# EAGLE design sens_less_blmd (EAGLE 9.6.2)
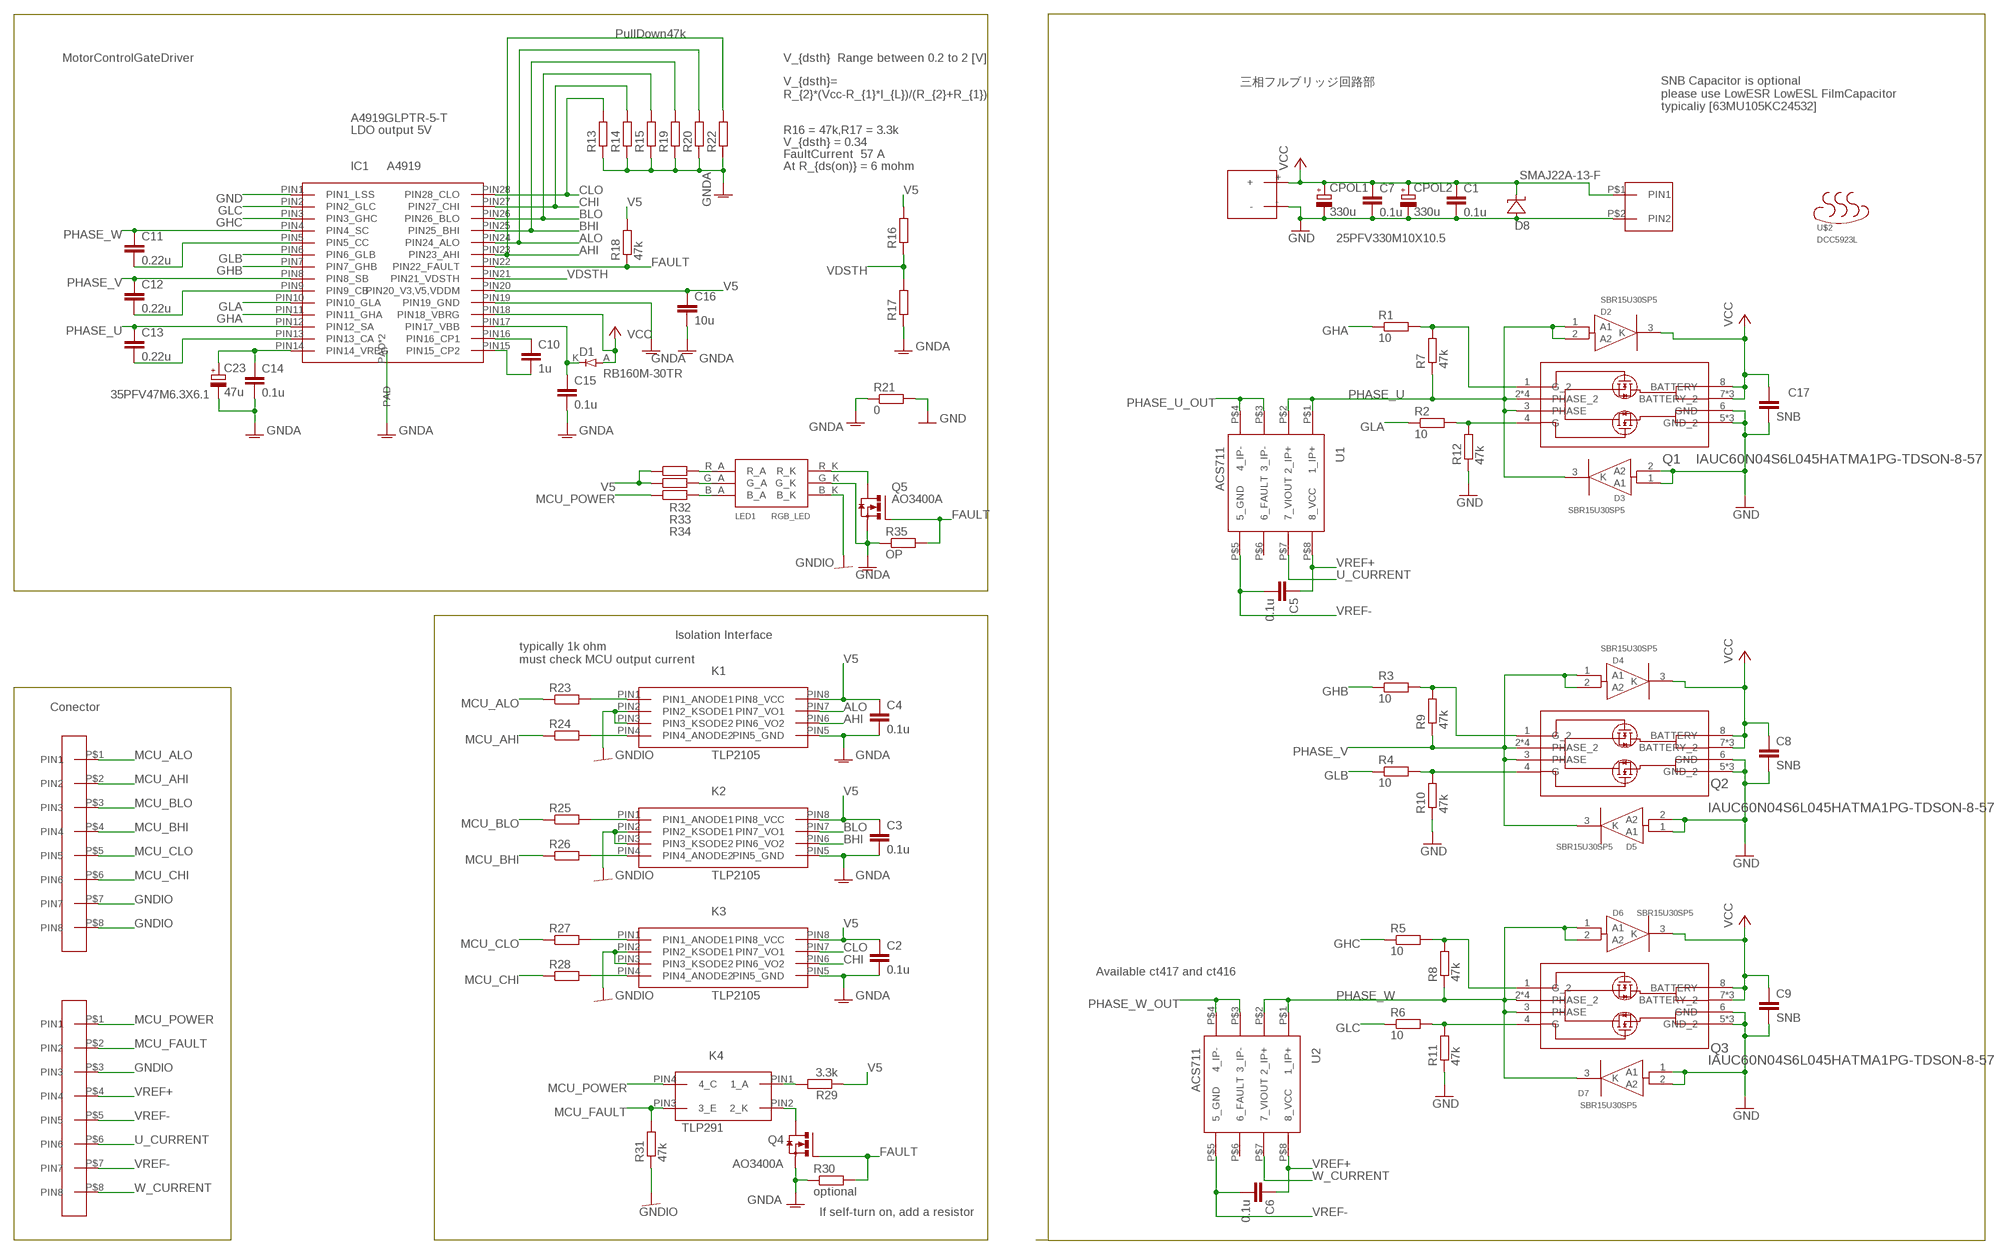
[diagram p0: schematic, sheet 1]

## Parts
C1  0.1u  C-EUC1608  [C1608]
C2  0.1u  C-EUC1608  [C1608]
C3  0.1u  C-EUC1608  [C1608]
C4  0.1u  C-EUC1608  [C1608]
C5  0.1u  C-EUC1608  [C1608]
C6  0.1u  C-EUC1608  [C1608]
C7  0.1u  C-EUC1608  [C1608]
C8  SNB  C-EUC4532  [C4532]
C9  SNB  C-EUC4532  [C4532]
C10  1u  C-EUC1608  [C1608]
C11  0.22u  C-EUC1608  [C1608]
C12  0.22u  C-EUC1608  [C1608]
C13  0.22u  C-EUC1608  [C1608]
C14  0.1u  C-EUC1608  [C1608]
C15  0.1u  C-EUC1608  [C1608]
C16  10u  C-EUC1608  [C1608]
C17  SNB  C-EUC4532  [C4532]
C23  47u  CPOL-EU153CLV-0605  [153CLV-0605]
CON1  XH_8P  [XH_8P]
CON2  XH_8P  [XH_8P]
CPOL1  330u  C_DEKAI  [1014CAPA]
CPOL2  330u  C_DEKAI  [1014CAPA]
D1  RB160M-30TR  SMD_DAIOD  [SOD_123]
D2  SBR15U30SP5  [POWERDI_5]
D3  SBR15U30SP5  [POWERDI_5]
D4  SBR15U30SP5  [POWERDI_5]
D5  SBR15U30SP5  [POWERDI_5]
D6  SBR15U30SP5  [POWERDI_5]
D7  SBR15U30SP5  [POWERDI_5]
D8  SMAJ22A-13-F  [DO-214AC]
IC1  A4919  [TSSOP_28P_ALLEGRO_E]
K1  TLP2105  [SOP8]
K2  TLP2105  [SOP8]
K3  TLP2105  [SOP8]
K4  TLP291  [TLP291]
LED1  RGB_LED  [RGB_LED]
Q1  IAUC60N04S6L045HATMA1PG-TDSON-8-57  [PG-TDSON-8-57]
Q2  IAUC60N04S6L045HATMA1PG-TDSON-8-57  [PG-TDSON-8-57]
Q3  IAUC60N04S6L045HATMA1PG-TDSON-8-57  [PG-TDSON-8-57]
Q4  AO3400A  SOT23_NFET  [SOT23]
Q5  AO3400A  SOT23_NFET  [SOT23]
R1  10  R_REG  [1608]
R2  10  R_REG  [1608]
R3  10  R_REG  [1608]
R4  10  R_REG  [1608]
R5  10  R_REG  [1608]
R6  10  R_REG  [1608]
R7  47k  R_REG  [1608]
R8  47k  R_REG  [1608]
R9  47k  R_REG  [1608]
R10  47k  R_REG  [1608]
R11  47k  R_REG  [1608]
R12  47k  R_REG  [1608]
R13  R_REG  [1608]
R14  R_REG  [1608]
R15  R_REG  [1608]
R16  R_REG  [1608]
R17  R_REG  [1608]
R18  47k  R_REG  [1608]
R19  R_REG  [1608]
R20  R_REG  [1608]
R21  0  R_REG  [1608]
R22  R_REG  [1608]
R23  R_REG  [1608]
R24  R_REG  [1608]
R25  R_REG  [1608]
R26  R_REG  [1608]
R27  R_REG  [1608]
R28  R_REG  [1608]
R29  3.3k  R_REG  [1608]
R30  optional  R_REG  [1608]
R31  47k  R_REG  [1608]
R32  R_REG  [1608]
R33  R_REG  [1608]
R34  R_REG  [1608]
R35  OP  R_REG  [1608]
U1  ACS711  [SOIC8]
U2  ACS711  [SOIC8]
U$1  XH_2P  [XH_2P]
U$2  DCC5923L  [DCC5923L]
U$22  XT60  [XT60]

## Nets
AHI: IC1.PIN23(PIN23_AHI) K1.PIN6(PIN6_VO2) R22.2
ALO: IC1.PIN24(PIN24_ALO) K1.PIN7(PIN7_VO1) R20.2
BHI: IC1.PIN25(PIN25_BHI) K2.PIN6(PIN6_VO2) R19.2
BLO: IC1.PIN26(PIN26_BLO) K2.PIN7(PIN7_VO1) R15.2
CHI: IC1.PIN27(PIN27_CHI) K3.PIN6(PIN6_VO2) R14.2
CLO: IC1.PIN28(PIN28_CLO) K3.PIN7(PIN7_VO1) R13.2
FAULT: IC1.PIN22(PIN22_FAULT) Q4.PIN1(PIN1_G) Q5.PIN1(PIN1_G) R18.1 R30.2 R35.2
GHA: IC1.PIN11(PIN11_GHA) R1.1
GHB: IC1.PIN7(PIN7_GHB) R3.1
GHC: IC1.PIN3(PIN3_GHC) R5.1
GLA: IC1.PIN10(PIN10_GLA) R2.1
GLB: IC1.PIN6(PIN6_GLB) R4.1
GLC: IC1.PIN2(PIN2_GLC) R6.1
GND: C1.2 C7.2 C8.2 C9.2 C17.2 CPOL1.- CPOL2.- D3.1(A1) D3.2(A2) D5.1(A1) D5.2(A2) D7.1(A1) D7.2(A2) D8.A IC1.PIN1(PIN1_LSS) Q1.5(GND_2) Q1.6(GND) Q1.SPAD(GND_2) Q1.SPAD@1(GND_2) Q2.5(GND_2) Q2.6(GND) Q2.SPAD(GND_2) Q2.SPAD@1(GND_2) Q3.5(GND_2) Q3.6(GND) Q3.SPAD(GND_2) Q3.SPAD@1(GND_2) R10.1 R11.1 R12.1 R21.2 U$1.P$2(PIN2) U$22.-
GNDA: C2.2 C3.2 C4.2 C14.2 C15.2 C16.2 C23.- IC1.PAD IC1.PAD@14(PAD) IC1.PIN19(PIN19_GND) K1.PIN5(PIN5_GND) K2.PIN5(PIN5_GND) K3.PIN5(PIN5_GND) LED1.G_K Q4.PIN2(PIN3_S) Q5.PIN2(PIN3_S) R13.1 R14.1 R15.1 R17.1 R19.1 R20.1 R21.1 R22.1 R30.1 R35.1
GNDIO: CON1.P$3(PIN3) CON2.P$7(PIN7) CON2.P$8(PIN8) K1.PIN2(PIN2_KSODE1) K1.PIN3(PIN3_KSODE2) K2.PIN2(PIN2_KSODE1) K2.PIN3(PIN3_KSODE2) K3.PIN2(PIN2_KSODE1) K3.PIN3(PIN3_KSODE2) LED1.B_K R31.1
MCU_AHI: CON2.P$2(PIN2) R24.1
MCU_ALO: CON2.P$1(PIN1) R23.1
MCU_BHI: CON2.P$4(PIN4) R26.1
MCU_BLO: CON2.P$3(PIN3) R25.1
MCU_CHI: CON2.P$6(PIN6) R28.1
MCU_CLO: CON2.P$5(PIN5) R27.1
MCU_FAULT: CON1.P$2(PIN2) K4.PIN3(3_E) R31.2
MCU_POWER: CON1.P$1(PIN1) K4.PIN4(4_C) R34.1
N$1: Q1.1(G_2) R1.2 R7.2
N$2: Q1.4(G) R2.2 R12.2
N$3: Q2.4(G) R4.2 R10.2
N$4: LED1.B_A R34.2
N$5: Q3.1(G_2) R5.2 R8.2
N$6: Q3.4(G) R6.2 R11.2
N$7: C10.1 IC1.PIN16(PIN16_CP1)
N$8: C10.2 IC1.PIN15(PIN15_CP2)
N$9: C14.1 C23.+ IC1.PIN14(PIN14_VREG)
N$11: K1.PIN1(PIN1_ANODE1) R23.2
N$12: K1.PIN4(PIN4_ANODE2) R24.2
N$13: K2.PIN1(PIN1_ANODE1) R25.2
N$14: K2.PIN4(PIN4_ANODE2) R26.2
N$15: K3.PIN1(PIN1_ANODE1) R27.2
N$16: C13.2 IC1.PIN13(PIN13_CA)
N$17: C12.2 IC1.PIN9(PIN9_CB)
N$18: C11.2 IC1.PIN5(PIN5_CC)
N$19: K3.PIN4(PIN4_ANODE2) R28.2
N$20: K4.PIN2(2_K) Q4.PIN3(PIN2_D)
N$21: C15.1 D1.K(C) IC1.PIN17(PIN17_VBB)
N$22: K4.PIN1(1_A) R29.2
N$23: Q2.1(G_2) R3.2 R9.2
N$24: LED1.G_A R33.2
N$25: LED1.R_A R32.2
N$26: LED1.R_K Q5.PIN3(PIN2_D)
PHASE_U: C13.1 D2.1(A1) D2.2(A2) D3.3(K) IC1.PIN12(PIN12_SA) Q1.2(PHASE_2) Q1.3(PHASE) Q1.SDPAD(PHASE_2) Q1.SDPAD@1(PHASE_2) Q1.SDPAD@2(PHASE_2) R7.1 U1.P$1(1_IP+) U1.P$2(2_IP+)
PHASE_U_OUT: U1.P$3(3_IP-) U1.P$4(4_IP-)
PHASE_V: C12.1 D4.1(A1) D4.2(A2) D5.3(K) IC1.PIN8(PIN8_SB) Q2.2(PHASE_2) Q2.3(PHASE) Q2.SDPAD(PHASE_2) Q2.SDPAD@1(PHASE_2) Q2.SDPAD@2(PHASE_2) R9.1
PHASE_W: C11.1 D6.1(A1) D6.2(A2) D7.3(K) IC1.PIN4(PIN4_SC) Q3.2(PHASE_2) Q3.3(PHASE) Q3.SDPAD(PHASE_2) Q3.SDPAD@1(PHASE_2) Q3.SDPAD@2(PHASE_2) R8.1 U2.P$1(1_IP+) U2.P$2(2_IP+)
PHASE_W_OUT: U2.P$3(3_IP-) U2.P$4(4_IP-)
U_CURRENT: CON1.P$6(PIN6) U1.P$7(7_VIOUT)
V5: C2.1 C3.1 C4.1 C16.1 IC1.PIN20(PIN20_V3,V5,VDDM) K1.PIN8(PIN8_VCC) K2.PIN8(PIN8_VCC) K3.PIN8(PIN8_VCC) R16.2 R18.2 R29.1 R32.1 R33.1
VCC: C1.1 C7.1 C8.1 C9.1 C17.1 CPOL1.+ CPOL2.+ D1.A D2.3(K) D4.3(K) D6.3(K) D8.C IC1.PIN18(PIN18_VBRG) Q1.7(BATTERY_2) Q1.8(BATTERY) Q1.DPAD(BATTERY_2) Q1.DPAD@1(BATTERY_2) Q2.7(BATTERY_2) Q2.8(BATTERY) Q2.DPAD(BATTERY_2) Q2.DPAD@1(BATTERY_2) Q3.7(BATTERY_2) Q3.8(BATTERY) Q3.DPAD(BATTERY_2) Q3.DPAD@1(BATTERY_2) U$1.P$1(PIN1) U$22.+
VDSTH: IC1.PIN21(PIN21_VDSTH) R16.1 R17.2
VREF+: C5.1 C6.1 CON1.P$4(PIN4) U1.P$8(8_VCC) U2.P$8(8_VCC)
VREF-: C5.2 C6.2 CON1.P$5(PIN5) CON1.P$7(PIN7) U1.P$5(5_GND) U2.P$5(5_GND)
W_CURRENT: CON1.P$8(PIN8) U2.P$7(7_VIOUT)
Unconnected: U1.P$6(6_FAULT) U2.P$6(6_FAULT)

## Notes on the sheet
- PullDown47k
- MotorControlGateDriver | V_{dsth}  Range between 0.2 to 2 [V]
- 三相フルブリッジ回路部
- V_{dsth}=
  R_{2}*(Vcc-R_{1}*I_{L})/(R_{2}+R_{1})
- SNB Capacitor is optional
  please use LowESR LowESL FilmCapacitor
  typicaliy [63MU105KC24532]
- A4919GLPTR-5-T
- LDO output 5V | R16 = 47k,R17 = 3.3k
- V_{dsth} = 0.34
- FaultCurrent  57 A
- At R_{ds(on)} = 6 mohm
- 25PFV330M10X10.5
- 35PFV47M6.3X6.1
- Isolation Interface
- typically 1k ohm
  must check MCU output current
- Conector
- Available ct417 and ct416
- If self-turn on, add a resistor

## Library data of the parts
C1-C17 = rcl:C-EU: CAPACITOR, European symbol; SPICEPREFIX: C
C23 = rcl:CPOL-EU: POLARIZED CAPACITOR, European symbol; SPICEPREFIX: C
CON1 CON2 = user_conector:XH_8P: jst JQコネクタ8pin ベース付きポスト 基板対基板コネクタ
CPOL1 CPOL2 = user_rcl:C_DEKAI
D1 = user_diode:SMD_DAIOD: パッケージはSOD123
D2-D7 = user_diode:SBR15U30SP5: Diodes スーパーバリア！（デデン！）ダイオード SBR15U30SP5 逆耐圧 30V 平均順電流 15A 瞬間電流 280A 順方向電圧降下 0.49V 秋月電子 通販コード : I-07391 Trrも記載されてればいいのになぁ。多分SBRのもとのショットキー自体がそこそこはやくそれをさらに高性能にしたものだから多分はやいんじゃね
D8 = user_diode:SMAJ22A-13-F: SMAJ22A-13-F TVSダイオード 逆スタンドオフ電圧:22V ブレークダウン電圧:24V 最大消費電力:400W
IC1 = user_ic:A4919: アレグロ：ブラシレスモータドライバ用ゲートドライバIC 純粋な両サイドNchハーフブリッジ3つを駆動するゲートドライバIC digikey：通販コード[620-1893-1-ND] 単価：353円
K1-K3 = user_ic:TLP2105: 二回路入り高速フォトカプラ ステートバッファ出力 秋月電子で買える 100nSほどの遅延
K4 = user_ic:TLP291: フォトリフレクタ オープンドレイン インバータ出力 秋月電子で買える
LED1 = user_leds:RGB_LED: KPF-3236SURKMGKPBC 秋月電子通商 117060
Q1-Q3 = user_tr_fet_igbt:IAUC60N04S6L045HATMA1: IAUC60N04S6L045HATMA1 digikey:448-IAUC60N04S6L045HATMA1CT-ND ハーフブリッジNchFET 40V 60A; COPYRIGHT: Copyright (C) 2024 Ultra Librarian. All rights reserved.; MANUFACTURER_PART_NUMBER: IAUC60N04S6L045HATMA1; MFR_NAME: Infineon
Q4 Q5 = user_tr_fet_igbt:SOT23_NFET
R1-R35 = user_rcl:R_REG: チップ抵抗
U1 U2 = user_ic:ACS711: アレグロ 電流センサIC ホールセンサ式の絶縁型電流センサ 12.5A、25Aの測定レンジの種類がある digikey：620-1372-1-ND 単価：295
U$1 = user_conector:XH_2P: トップ型xhコネクタ2ピン 秋月に売ってるやつ
U$2 = user_heatshink:DCC5923L: DCC5923L ALPHA 58.5x23 高さ設定可
U$22 = user_conector:XT60

## Board
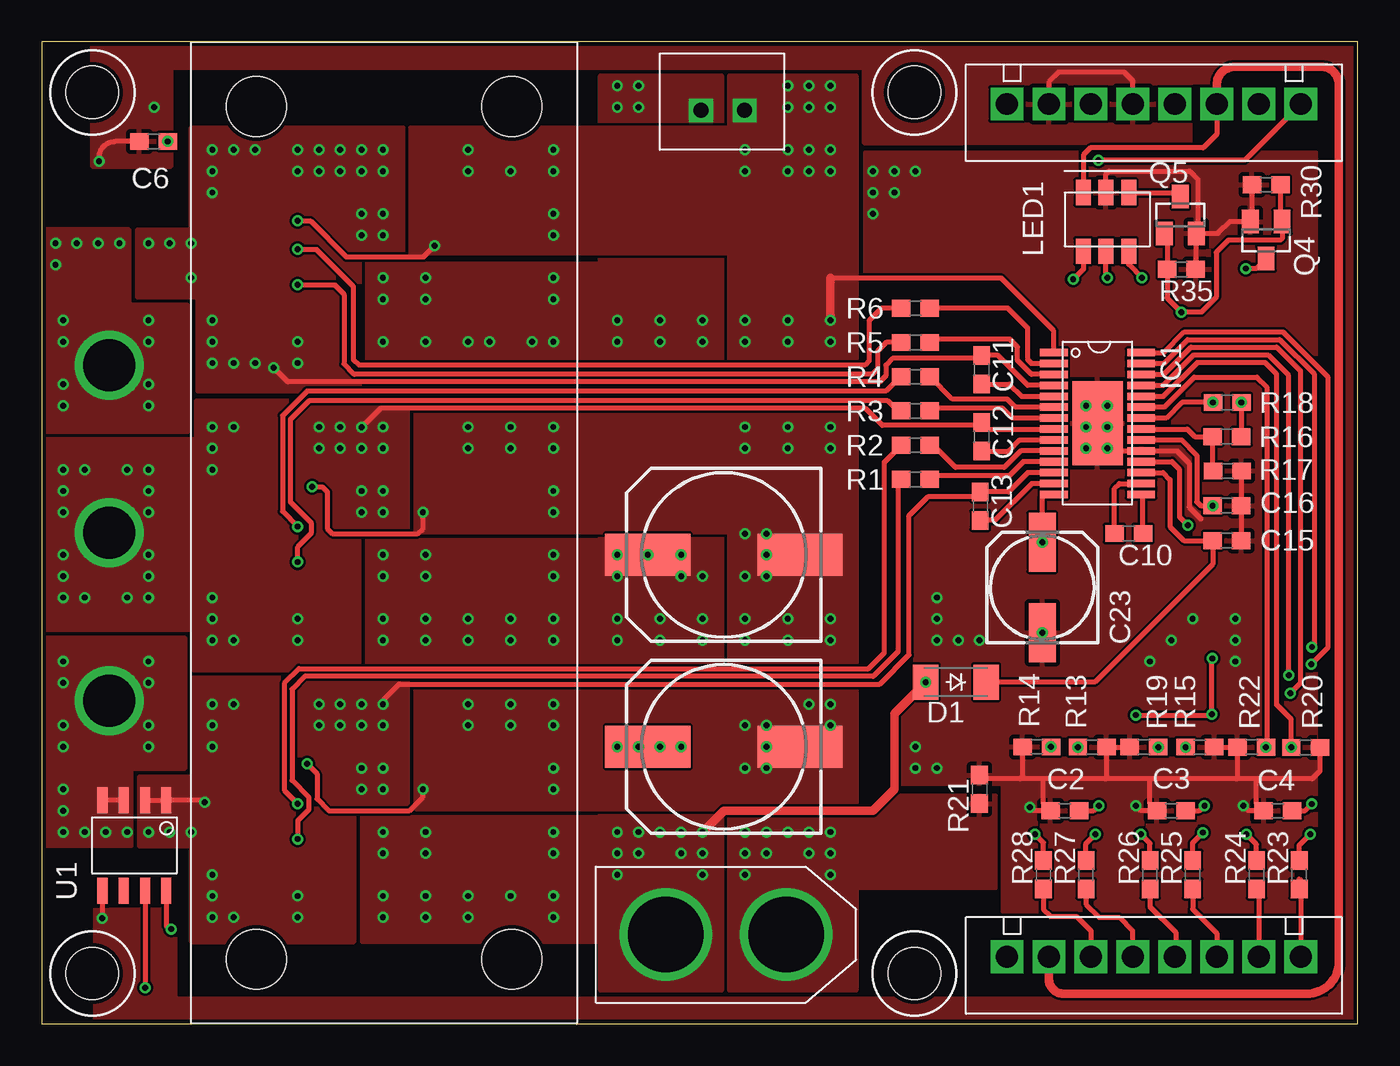
[diagram p1: board, top side]
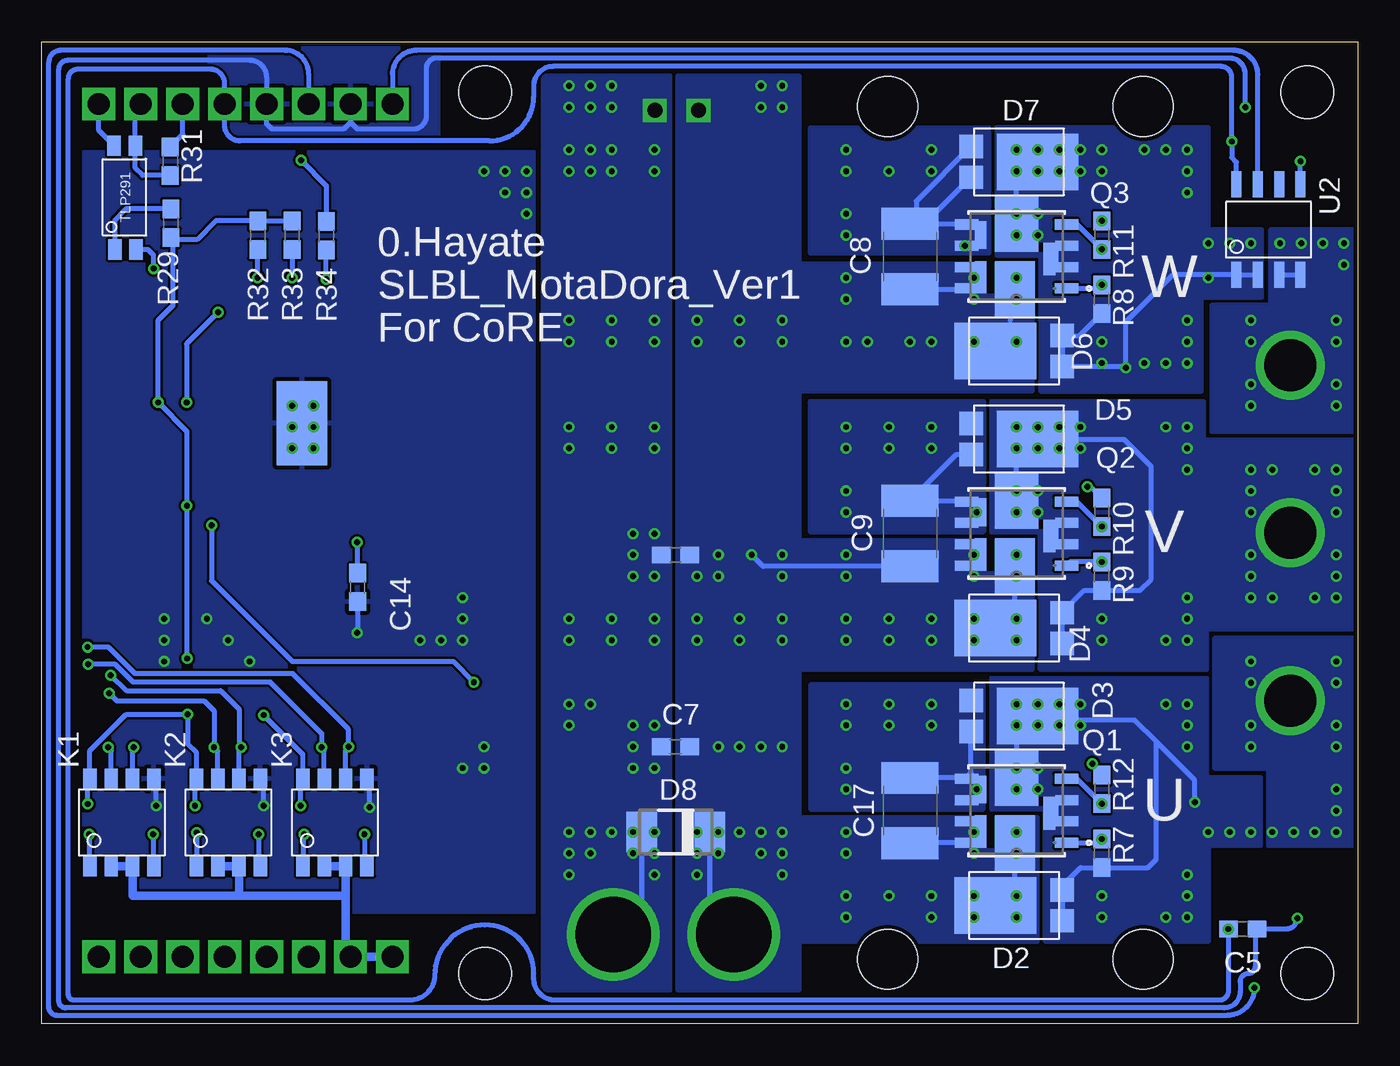
[diagram p2: board, bottom side, seen from below]

Size 78.41 x 58.5 mm. Coordinates in mm from the lower left corner, seen from the top.
Outline: 0,0 78.41,0 78.41,58.5 0,58.5 0,0
Copper layers (1*16): Top 0.035mm / dielectric 1.5mm / Bottom 0.035mm
Design rules "SeeedStudio_2layer_DRU_no_angle_20140221": minimum track width 6mil, minimum drill 12mil, track to track 6mil, track to pad 6mil, pad to pad 6mil, via to via 6mil, smd to smd 0mil, copper to edge 10mil, drill to drill 10mil, minimum pad ring 10mil, minimum via ring 6mil, stop-mask expansion 2mil, vias tented up to drill 100mil, thermal gap 10mil
Holes 3.1 mm at 3,55.5 3,3 52,3 52,55.5

### Footprints (pad centres in the part's own frame; a part is rotated, then mirrored left to right if it is on the bottom)
C1608 = smd 1.1 x 1: 1 -0.85,0; 2 0.85,0
C4532 = smd 1.9 x 3.4: 1 -1.95,0; 2 1.95,0
153CLV-0605 = smd 3.5 x 1.6: + 2.7,0; - -2.7,0
XH_8P = drill 1.3 square: P$1 2.45,2.35; P$2 4.95,2.35; P$3 7.45,2.35; P$4 9.95,2.35; P$5 12.45,2.35; P$6 14.95,2.35; P$7 17.45,2.35; P$8 19.95,2.35
1014CAPA = smd 5.079 x 2.5: + 4.531,0; - -4.531,0
SOD_123 = smd 1.5 x 2.1: A 1.8,0; K -1.8,0
POWERDI_5 = smd 1.39 x 1.4: 1 1.063,-0.177; 2 2.903,-0.177 | smd 3.36 x 4.86: 3 1.983,3.805
DO-214AC = smd 1.8 x 2.4: A 2.025,0; C -2.025,0
TSSOP_28P_ALLEGRO_E = smd 5 x 3: PAD 4.85,1.95 | smd 5 x 3 bottom: PAD@14 4.85,1.95 | smd 0.45 x 1.65: PIN1 0.65,-0.65; PIN2 1.3,-0.65; PIN3 1.95,-0.65; PIN4 2.6,-0.65; PIN5 3.25,-0.65; PIN6 3.9,-0.65; PIN7 4.55,-0.65; PIN8 5.2,-0.65; PIN9 5.85,-0.65; PIN10 6.5,-0.65; PIN11 7.15,-0.65; PIN12 7.8,-0.65; PIN13 8.45,-0.65; PIN14 9.1,-0.65; PIN15 9.1,4.55; PIN16 8.45,4.55; PIN17 7.8,4.55; PIN18 7.15,4.55; PIN19 6.5,4.55; PIN20 5.85,4.55; PIN21 5.2,4.55; PIN22 4.55,4.55; PIN23 3.9,4.55; PIN24 3.25,4.55; PIN25 2.6,4.55; PIN26 1.95,4.55; PIN27 1.3,4.55; PIN28 0.65,4.55
SOP8 = smd 0.8 x 1.2: PIN1 0.65,-4.57; PIN2 1.92,-4.57; PIN3 3.19,-4.57; PIN4 4.46,-4.57; PIN5 4.46,0.62; PIN6 3.19,0.62; PIN7 1.92,0.62; PIN8 0.65,0.62
TLP291 = smd 1.2 x 0.8: PIN1 0.411,-0.862; PIN2 0.411,-2.132; PIN3 6.601,-2.092; PIN4 6.601,-0.822
RGB_LED = smd 1.5 x 0.9: B_A 3.5,-2.7; B_K 0,-2.7; G_A 3.5,-1.35; G_K 0,-1.35; R_A 3.5,0; R_K 0,0
PG-TDSON-8-57 = smd 1.4 x 0.6: 1 -2.97,1.905; 4 -2.97,-1.905 | smd 1.17 x 0.6: 2 -3.085,0.635; 3 -3.085,-0.635; 5 3.085,-1.905; 6 3.085,-0.635; 7 3.085,0.635; 8 3.085,1.905 | smd 2.39 x 3.315: DPAD 0.105,1.942 | smd 0.7 x 1.92: DPAD@1 2.15,1.245 | smd 2.6 x 3.315: SDPAD 0,-1.942 | smd 0.7 x 1.95: SDPAD@1 -1.96,0.15 | smd 0.19 x 1.87: SDPAD@2 -2.405,0 | smd 0.47 x 1.65: SPAD 2.035,-1.27 | smd 0.23 x 1.87: SPAD@1 2.385,-1.27
SOT23 = smd 1 x 1.4: PIN1 -0.95,-1.1; PIN2 0.95,-1.1; PIN3 0,1.1
1608 = smd 1.1 x 1: 1 -0.85,0; 2 0.85,0
SOIC8 = smd 1.55 x 0.6: P$1 -2.7,1.905; P$2 -2.7,0.635; P$3 -2.7,-0.635; P$4 -2.7,-1.905; P$5 2.7,-1.905; P$6 2.7,-0.635; P$7 2.7,0.635; P$8 2.7,1.905
XH_2P = drill 0.9 square: P$1 2.45,2.35; P$2 5.05,2.35
DCC5923L = hole 3.56: 3.88,3.85; 19.12,3.85; 19.12,54.65; 3.88,54.65
XT60 = drill 4.5: + 4.15,4.05; - 11.35,4.05

### Placement (x,y rotation side)
C1  40.64,27.94 180 bottom
C2  60.96,12.7 180 top
C3  67.31,12.7 180 top
C4  73.66,12.7 180 top
C5  6.85,5.65 0 bottom
C6  6.65,52.57 180 top
C7  40.64,16.51 180 bottom
C8  26.67,45.72 90 bottom
C9  26.67,29.21 90 bottom
C10  64.77,29.21 0 top
C11  56,38.97 270 top
C12  56,34.97 270 top
C13  55.92,30.85 270 top
C14  59.6,26 270 bottom
C15  70.62,28.79 0 top
C16  70.62,30.87 0 top
C17  26.67,12.7 90 bottom
C23  59.62,26 90 top
CON1  77.47,57.15 180 top
CON2  77.47,6.35 180 top
CPOL1  40.64,27.94 180 top
CPOL2  40.64,16.51 180 top
D1  54.47,20.36 180 top
D2  17.78,5.08 90 bottom
D3  22.86,20.32 270 bottom
D4  17.78,21.59 90 bottom
D5  22.86,36.83 270 bottom
D6  17.78,38.1 90 bottom
D7  22.86,53.34 270 bottom
D8  40.64,11.43 180 bottom
IC1  60.96,40.64 270 top
K1  76.2,13.97 0 bottom
K2  69.85,13.97 0 bottom
K3  63.5,13.97 0 bottom
K4  74.93,45.72 90 bottom
LED1  64.77,49.53 270 top
Q1  20.32,12.7 180 bottom
Q2  20.32,29.21 180 bottom
Q3  20.32,45.72 180 bottom
Q4  72.96,46.69 180 top
Q5  67.85,48.19 0 top
R1  52.07,32.44 180 top
R2  52.07,34.48 180 top
R3  52.07,36.52 180 top
R4  52.07,38.56 180 top
R5  52.07,40.6 180 top
R6  52.07,42.64 180 top
R7  15.24,10.16 90 bottom
R8  15.24,43.18 90 bottom
R9  15.24,26.67 90 bottom
R10  15.24,30.48 270 bottom
R11  15.24,46.99 270 bottom
R12  15.24,13.97 270 bottom
R13  62.59,16.49 180 top
R14  59.29,16.5 0 top
R15  69.01,16.49 180 top
R16  70.62,34.98 0 top
R17  70.64,32.94 180 top
R18  70.64,37.02 0 top
R19  65.68,16.49 0 top
R20  75.31,16.47 180 top
R21  55.88,13.97 270 top
R22  72.1,16.48 0 top
R23  74.93,8.89 90 top
R24  72.39,8.89 90 top
R25  68.58,8.89 90 top
R26  66.04,8.89 90 top
R27  62.23,8.89 90 top
R28  59.69,8.89 90 top
R29  70.72,47.7 90 bottom
R30  72.96,49.99 0 top
R31  70.76,51.4 270 bottom
R32  65.54,46.99 270 bottom
R33  63.5,46.99 270 bottom
R34  61.46,46.96 270 bottom
R35  67.91,44.95 180 top
U1  5.51,10.63 270 top
U2  5.31,47.32 90 bottom
U$1  36.83,52.07 0 top
U$2  8.89,0 0 top
U$22  33.02,1.27 0 top

### Tracks (layer width: path | path; a pad name or v marks a point on that pad's centre or on a via)
AHI  (via drill 0.35)
  Top 0.305: IC1.PIN23 66.88,36.74 68.67,38.53 72.41,38.53 72.99,37.95 72.99,16.52 R22.2
  Bottom 0.305: K1.PIN6 73.01,16.42 R22.2
  other vias: 72.95,16.48
ALO  (via drill 0.35)
  Top 0.305: IC1.PIN24 66.84,37.39 68.85,39.4 72.9,39.4 73.58,38.72 73.58,19.03 74.46,18.15 R20.2
  Bottom 0.305: K1.PIN7 74.28,16.29 R20.2
  other vias: 74.46,16.47
BHI  (via drill 0.35)
  Top 0.305: IC1.PIN25 66.85,38.04 68.66,39.86 73.09,39.86 74.27,38.68 74.27,20.81 v74.3,20.78
  Bottom 0.305: K2.PIN6 66.66,16.36 | 66.66,16.36 R19.2 | v74.3,20.78 73.37,19.85 67.76,19.85 66.66,18.75 66.66,16.36
  other vias: 66.53,16.49
BLO  (via drill 0.35)
  Top 0.305: IC1.PIN26 66.85,38.69 68.47,40.31 73.59,40.31 75,38.9 75,20.3 v74.4,19.7
  Bottom 0.305: K2.PIN7 67.93,16.26 R15.2 68.16,18.66 68.75,19.25 73.95,19.25 v74.4,19.7
  other vias: 68.16,16.49
CHI  (via drill 0.35)
  Top 0.305: IC1.PIN27 65.54,39.37 66.88,39.37 68.28,40.77 73.78,40.77 75.82,38.73 75.82,22.57 v75.69,22.45
  Bottom 0.305: K3.PIN6 60.31,16.33 R14.2 60.14,17.55 63.46,20.87 72.85,20.87 74.43,22.45 v75.69,22.45
  other vias: 60.14,16.5
CLO  (via drill 0.35)
  Top 0.305: IC1.PIN28 66.86,39.99 68.1,41.23 73.96,41.23 76.63,38.57 76.63,22.4 v75.66,21.43
  Bottom 0.305: K3.PIN7 61.58,16.33 R13.2 61.74,17.29 64.81,20.36 72.98,20.36 74.04,21.41 75.64,21.41 v75.66,21.43
  other vias: 61.74,16.49
FAULT  (via drill 0.35)
  Top 0.305: R30.2 73.81,47.89 Q4.PIN1 73.91,46.79 73.81,46.69 70.71,46.69 69.99,45.97 69.99,43.29 69.1,42.4 v67.9,42.4 67.06,43.24 R35.2 67.06,46.93 Q5.PIN1 | R18.1 67.94,37.02 67.01,36.09 IC1.PIN22
  Bottom 0.305: v67.9,42.4 69.79,40.51 R18.1
  other vias: 69.79,37.02
GHA
  Top 0.305: IC1.PIN11 58.49,33.49 57.66,32.66 53.26,32.66 53,32.4 52.96,32.4 R1.1
GHB
  Top 0.305: IC1.PIN7 57.83,36.09 57.23,36.69 53.09,36.69 R3.1
GHC
  Top 0.305: R5.1 53.12,40.8 57.68,40.8 58.15,40.33 58.15,39.52 58.98,38.69 IC1.PIN3
GLA
  Top 0.305: IC1.PIN10 58.34,34.14 57.36,33.16 54.44,33.16 53.12,34.48 R2.1
GLB
  Top 0.305: IC1.PIN6 58.03,36.74 57.54,37.23 54.27,37.23 52.94,38.56 R4.1
GLC
  Top 0.305: IC1.PIN2 60.3,39.33 58.99,39.33 58.73,39.59 58.73,41.48 57.57,42.64 R6.1
GND  (via drill 0.35)
  Top 0.305: R11.1 16,47.84 18.14,45.7 22.75,45.7 Q3.6 | v15.8,15.5 16.4,14.9 16.4,13.4 17.1,12.7 21.9,12.7 22.7,13.51 Q1.SPAD@1 | v16.1,32 16.7,32 17,31.7 17,29.5 17.3,29.2 22.4,29.2 22.7,29.5 Q2.SPAD@1 | IC1.PIN1 60.31,41.29 57.15,44.45 46.99,44.45
  Top 0.508: v46.99,41.91 46.99,44.45
  Bottom 0.305: D8.A 42.66,7.03 U$22.- | C8.2 26.3,47.67 | 25.8,47.67 23.45,47.67 Q3.5 | D7.2 25.8,47.67 | 25.8,47.67 26.3,47.67 | D7.1 26.3,49.01 26.3,47.67 | D5.2 23.9,33.93 C9.2 23.45,31.16 Q2.5 | D3.2 23.04,14.97 Q1.5 23.45,14.65 C17.2 | R12.1 15.24,14.94 v15.8,15.5 | R10.1 15.91,32 v16.1,32
  other vias: 15.24,47.84 23.41,46.35 22.7,13.97 22.7,30.48 45.72,11.43 46.99,11.43 46.99,10.16 46.99,8.89 41.91,15.24 43.18,15.24 43.18,16.51 43.18,17.78 41.91,17.78 41.91,26.67 43.18,26.67 43.18,27.94 44.45,34.29 44.45,35.56 43.18,29.21 41.91,29.21 46.99,34.29 41.91,34.29 41.91,35.56 46.99,35.56 41.91,40.64 41.91,41.91 44.45,41.91 44.45,40.64 46.99,40.64 41.91,50.8 44.45,50.8 45.72,50.8 46.99,50.8 46.99,52.07 45.72,52.07 44.45,52.07 41.91,52.07 44.45,54.61 44.45,55.88 45.72,55.88 45.72,54.61 46.99,54.61 46.99,55.88 41.91,24.13 41.91,22.86 44.45,22.86 44.45,24.13 46.99,24.13 46.99,22.86 46.99,19.05 46.99,17.78 45.72,19.05 41.91,8.89 41.91,11.43 41.91,10.16 43.18,10.16 43.18,11.43 44.45,11.43 45.72,10.16 25.4,52.07 25.4,50.8 27.94,50.8 30.48,50.8 30.48,52.07 30.48,48.26 30.48,46.99 25.4,35.56 25.4,34.29 27.94,34.29 27.94,35.56 30.48,35.56 30.48,34.29 30.48,31.75 30.48,30.48 25.4,19.05 25.4,17.78 27.94,17.78 27.94,19.05 30.48,19.05 30.48,17.78 30.48,15.24 30.48,13.97
  pour Bottom (no thermals): 22.3,12.8 22.3,20.2 32.6,20.2 32.6,12.8
  pour Bottom (no thermals): 32.6,29.3 32.6,37.1 22.3,37.1 22.3,29.3
  pour Bottom (no thermals): 32.6,45.9 32.6,53.4 22,53.4 22,45.9
  pour Top (no thermals): 41,56.5 48.5,56.5 48.5,2 41,2
  pour Bottom (no thermals): 41,56.5 41,2 48.5,2 48.5,56.5
  pour Top (no thermals): 48.5,20.5 48.5,12.8 22.3,12.8 22.3,20.5
  pour Top (no thermals): 22.3,37.1 48.5,37.1 48.5,29.3 22.3,29.3
  pour Top (no thermals): 22,53.4 48.5,53.4 48.5,45.9 22,45.9
  pour Top: 46.5,13.6 56.8,13.6 56.8,8.1 46.5,8.1
GNDA  (via drill 0.35)
  Top 0.152: 62.91,37.8 62.87,37.85 | IC1.PAD 63.14,35.56 v63.5,35.56 | IC1.PAD 62.91,35.22 62.87,35.18 | IC1.PAD 62.91,34.97 v62.23,34.29 | IC1.PAD 62.91,34.88 v63.5,34.29 | v63.5,36.83 62.91,36.83 IC1.PAD | v62.23,36.83 62.23,36.47 IC1.PAD
  Top 0.305: v65.19,13 65.49,12.7 C3.2 66.04,13.12 66.04,14.6 | v71.59,13 71.89,12.7 C4.2 72.39,13.12 72.39,14.6 | v58.89,12.9 59.09,12.7 C2.2 59.69,13.12 59.69,14.6 | R30.1 72.11,47.89 Q4.PIN2 70.79,47.79 70.09,47.09 Q5.PIN2 | Q5.PIN2 68.9,46.99 68.9,50.3 68.4,50.8 63.6,50.8 63.42,50.62 LED1.G_K | 69.09,30.07 68.37,30.79 68.37,33.4 67.63,34.14 IC1.PIN19 64.24,34.14 64.24,34.46 IC1.PAD | Q5.PIN2 68.76,47.05 R35.1 | R17.1 71.49,30.89 C16.2 C15.2 | R20.1 76.16,15.06 75.7,14.6 72.39,14.6 | 72.39,14.6 71.2,14.6 | 71.2,14.6 66.04,14.6 | 66.04,14.6 63.4,14.6 | 63.4,14.6 59.69,14.6 | 59.69,14.6 58.3,14.6 | 58.3,14.6 56.1,14.6 R21.1 | 71.2,14.6 71.25,14.65 R22.1 R15.1 | R19.1 R13.1 63.44,14.64 63.4,14.6 | R14.1 58.44,14.74 58.3,14.6
  Bottom 0.152: IC1.PAD 62.91,35.22 62.87,35.18 | IC1.PAD 62.91,36.24 | 62.91,37.8 62.87,37.85 | IC1.PAD 62.68,35.56 v62.23,35.56 | IC1.PAD 63.14,35.56 v63.5,35.56
  Bottom 0.305: v65.19,13 65.19,14.39 K2.PIN5 | v71.59,13 71.59,14.44 K1.PIN5 | v58.89,12.9 58.89,14.44 K3.PIN5 | C14.2 59.6,23.32 C23.-
  other vias: 59.62,23.3 53.34,15.24 52.07,15.24 52.07,16.51 55.88,22.86 54.61,22.86 53.34,22.86 53.34,24.13 53.34,25.4 66.04,21.59 67.31,22.86 68.58,24.13 71.12,21.59 71.12,22.86 71.12,24.13 49.53,48.26 49.53,49.53 49.53,50.8 50.8,49.53 50.8,50.8 52.07,50.8
  pour Top: 49.1,51.9 75.9,51.9 75.9,6.7 57.3,6.7 57.3,14.3 49.1,14.3
  pour Bottom: 49.1,51.9 75.9,51.9 75.9,6.7 49.1,6.7
GNDIO
  Top 0.305: CON1.P$3 70.02,54.61 70.02,52.99 69.22,52.19 62.49,52.19 62.07,51.77 LED1.B_K
  Top 0.508: CON2.P$7 60.02,2.65 arc90 60.87,1.8 75.4,1.8 arc90 77.3,3.7 77.3,55.97 arc90 76.25,57.02 71.09,57.02 arc90 70.02,55.95 70.02,54.61
  Bottom 0.305: R31.1 70.02,52.99 CON1.P$3
  Bottom 0.508: K3.PIN2 K3.PIN3 60.31,7.64 | K2.PIN2 K2.PIN3 66.66,7.64 | K1.PIN2 K1.PIN3 73.01,7.64 66.66,7.64 | 60.31,7.64 60.31,4.29 CON2.P$7 CON2.P$8 | 60.31,7.64 66.66,7.64
MCU_AHI
  Top 0.305: R24.1 72.52,7.91 CON2.P$2
MCU_ALO
  Top 0.305: R23.1 74.93,8.64 75.02,8.55 CON2.P$1
MCU_BHI
  Top 0.305: R26.1 66.04,6.99 67.57,5.46 67.57,4.05 CON2.P$4
MCU_BLO
  Top 0.305: R25.1 68.58,6.84 70.02,5.4 CON2.P$3
MCU_CHI
  Top 0.305: CON2.P$6 62.52,5.54 61.66,6.4 60.09,6.4 59.69,6.8 R28.1
MCU_CLO
  Top 0.305: R27.1 62.23,7.14 63.02,6.35 64.21,6.35 65,5.56 65,4.02 CON2.P$5
MCU_FAULT
  Bottom 0.305: CON1.P$2 72.84,54.48 K4.PIN3 72.84,50.98 72.41,50.55 R31.2
MCU_POWER  (via drill 0.35)
  Top 0.305: v62.97,51.46 v62.98,51.46 71.68,51.46 CON1.P$1
  Bottom 0.305: K4.PIN4 75.02,53.23 CON1.P$1 | v62.97,51.46 61.46,49.95 R34.1
N$1  (via drill 0.35)
  Top 0.305: R7.2 15.24,12.11 15.9,12.77 15.9,13.5 14.9,14.5 14.9,19.94 15.66,20.7 49.55,20.7 51.02,22.17 51.02,32.24 R1.2
  Bottom 0.305: Q1.1 15.46,10.79 R7.2
  other vias: 15.24,11.01
N$2  (via drill 0.35)
  Top 0.305: R12.2 14.44,13.92 14.44,20.29 15.32,21.17 49.27,21.17 50.2,22.1 50.2,33.46 R2.2
  Bottom 0.305: R12.2 16.73,14.61 Q1.4
  other vias: 15.24,13.12
N$3  (via drill 0.35)
  Top 0.305: R4.2 51.16,38.56 50.3,37.7 15.8,37.7 14.34,36.24 14.34,30.53 R10.2
  Bottom 0.305: R10.2 16.73,31.11 Q2.4
  other vias: 15.24,29.63
N$4  (via drill 0.35)
  Top 0.305: LED1.B_A 62.07,44.97 v61.46,44.36
  Bottom 0.305: v61.46,44.36 R34.2
N$5  (via drill 0.35)
  Top 0.305: R5.2 50.32,40.6 49.8,40.08 49.8,39 49.5,38.7 18.62,38.7 18,39.32 18,43.47 17.44,44.03 R8.2
  Bottom 0.305: Q3.1 15.46,43.81 R8.2
  other vias: 15.24,44.03
N$6  (via drill 0.35)
  Top 0.305: R11.2 16.35,46.14 18.55,43.94 18.55,39.58 18.89,39.24 49.04,39.24 49.3,39.5 49.3,41.9 50.04,42.64 R6.2
  Bottom 0.305: R11.2 16.73,47.62 Q3.4
  other vias: 15.24,46.14
N$7
  Top 0.305: C10.1 63.92,31.9 64.21,32.19 IC1.PIN16
N$8
  Top 0.305: C10.2 65.62,31.43 IC1.PIN15
N$9  (via drill 0.35)
  Top 0.305: C23.+ 59.62,31.35 59.81,31.54 IC1.PIN14
  Bottom 0.305: C14.1 59.6,28.68 C23.+
  other vias: 59.62,28.7
N$11  (via drill 0.35)
  Top 0.305: R23.2 74.93,10.64 v75.59,11.3
  Bottom 0.305: v75.59,11.3 75.59,9.44 K1.PIN1
N$12  (via drill 0.35)
  Top 0.305: R24.2 72.39,10.7 v71.79,11.3
  Bottom 0.305: v71.79,11.3 71.79,9.45 K1.PIN4
N$13  (via drill 0.35)
  Top 0.305: R25.2 68.58,10.79 v69.19,11.4
  Bottom 0.305: v69.19,11.4 v69.2,11.39 K2.PIN1
N$14  (via drill 0.35)
  Top 0.305: R26.2 66.04,10.75 v65.49,11.3
  Bottom 0.305: v65.49,11.3 65.49,9.5 K2.PIN4
N$15  (via drill 0.35)
  Top 0.305: R27.2 62.23,10.74 v62.79,11.3
  Bottom 0.305: v62.79,11.3 62.85,11.24 K3.PIN1
N$16
  Top 0.305: IC1.PIN13 58.99,32.19 56.8,30 C13.2
N$17
  Top 0.305: C12.2 57.59,34.12 58.27,34.8 IC1.PIN9
N$18
  Top 0.305: C11.2 57.66,38.12 58.39,37.39 IC1.PIN5
N$19  (via drill 0.35)
  Top 0.305: R28.2 59.69,10.8 v59.19,11.3
  Bottom 0.305: v59.19,11.3 59.19,9.55 K3.PIN4
N$20  (via drill 0.35)
  Top 0.305: Q4.PIN3 72.37,45 v71.76,45
  Bottom 0.305: v71.76,45 71.76,45.8 72.09,46.13 K4.PIN2
N$21
  Top 0.305: IC1.PIN17 66.82,32.84 67.23,32.43 67.23,29.63 68.07,28.79 C15.1 69.77,27.39 62.74,20.36 D1.K
N$22
  Bottom 0.305: R29.2 73.41,48.55 74.07,47.89 K4.PIN1
N$23  (via drill 0.35)
  Top 0.305: R3.2 51.02,36.52 50.42,37.12 15.92,37.12 14.8,36 14.8,31.1 16.04,29.86 16.04,29.22 15.24,28.42 R9.2
  Bottom 0.305: R9.2 17.14,27.52 Q2.1
  other vias: 15.24,27.52
N$24  (via drill 0.35)
  Top 0.305: v63.5,44.45 63.42,44.53 LED1.G_A
  Bottom 0.305: R33.2 v63.5,44.45
N$25  (via drill 0.35)
  Top 0.305: LED1.R_A 64.77,45.25 v65.56,44.46
  Bottom 0.305: v65.56,44.46 65.56,46.12 R32.2
N$26
  Top 0.305: LED1.R_K 67.61,49.53 Q5.PIN3
PHASE_U  (via drill 0.35)
  Top 0.305: IC1.PIN12 58.76,32.84 57.62,31.7 C13.1 55.62,31.4 52.8,31.4 51.68,30.28 51.68,21.98 49.94,20.24 21.3,20.24 20.32,19.27 v20.32,19.05 | U1.P$2 U1.P$1 9.57,13.33 v9.7,13.2
  Bottom 0.305: D3.3 19.3,18.1 | 19.3,18.1 20.32,17.07 v20.32,15.24 Q1.SDPAD | D2.1 D2.2 17.6,8.22 16.51,9.31 R7.1 12.49,9.31 12,9.8 12,16.8 | 19.3,18.1 13.3,18.1 12,16.8 | Q1.SDPAD@1 18.36,12.86 | 19.97,14.47 20.32,14.47 | v9.7,13.2 9.7,14.5 12,16.8
  other vias: 20.32,17.78 6.35,11.43 7.62,11.43 8.89,11.43 10.16,8.89 10.16,7.62 10.16,6.35 11.43,6.35 15.24,6.35 15.24,7.62 10.16,16.51 10.16,17.78 10.16,19.05 11.43,19.05 16.51,17.78 16.51,19.05 17.78,17.78 17.78,19.05 19.05,19.05 19.05,17.78 19.05,15.24 19.05,13.97 20.32,13.97
  pour Top (no thermals): 5.8,10.6 8.9,10.6 8.9,4.9 18.6,4.9 18.6,12.8 21.8,12.8 21.8,20.6 9,20.6 9,14.7 5.8,14.7
  pour Bottom (no thermals): 8.9,4.9 18.6,4.9 18.6,12.8 21.8,12.8 21.8,20.6 9,20.6 9,14.7 5.8,14.7 5.8,10.6 8.9,10.6
PHASE_U_OUT  (via drill 0.35, 3.1)
  Top 0.305: U1.P$3 U1.P$4
  other vias: 4,19.25 1.27,21.59 1.27,20.32 6.35,21.59 6.35,20.32 6.35,17.78 6.35,16.51 1.27,17.78 1.27,16.51 1.27,13.97 1.27,12.7 1.27,11.43 2.54,11.43 3.81,11.43 5.08,11.43
  pour Top (no thermals): -1.2,23 8.5,23 8.5,15.2 5.3,15.2 5.3,10.6 -1.2,10.6
  pour Bottom (no thermals): -1.2,10.6 5.3,10.6 5.3,15.2 8.5,15.2 8.5,23 -1.2,23
PHASE_V  (via drill 0.35, 3.1)
  Top 0.305: IC1.PIN8 56,35.44 C12.1 55.83,35.65 50.09,35.65 49.08,36.66 20.17,36.66 v19.05,35.55
  Bottom 0.305: 19.8,34.8 v19.05,35.55 | D4.2 | D4.2 16.28,25.82 R9.1 12.98,25.82 12.3,26.5 12.3,33.2 13.9,34.8 19.8,34.8 | 19.8,34.8 20.32,34.8 v20.32,31.75 Q2.SDPAD 19.95,31.15 | D4.1 D4.2
  other vias: 4,29.25 1.27,33.02 2.54,33.02 5.08,33.02 6.35,33.02 6.35,31.75 6.35,30.48 1.27,31.75 1.27,30.48 1.27,27.94 1.27,26.67 1.27,25.4 2.54,25.4 5.08,25.4 6.35,25.4 6.35,26.67 6.35,27.94 10.16,35.56 11.43,35.56 10.16,34.29 10.16,33.02 10.16,25.4 10.16,24.13 10.16,22.86 11.43,22.86 15.24,22.86 15.24,24.13 19.05,30.48 20.32,30.48 19.05,31.75 16.51,34.29 16.51,35.56 17.78,34.29 17.78,35.56 19.05,34.29 20.32,34.29 20.32,35.56
  pour Bottom (no thermals): 21.8,37.1 9.2,37.1 9.2,34.8 -5.2,34.8 -5.2,23.5 9,23.5 9,21.1 18.9,21.1 18.9,29.3 21.8,29.3
  pour Top (no thermals): -5.2,34.8 -5.2,23.5 9,23.5 9,21.1 18.9,21.1 18.9,29.3 21.8,29.3 21.8,37.1 9.2,37.1 9.2,34.8
PHASE_W  (via drill 0.35)
  Top 0.305: IC1.PIN4 58.76,38.04 56.98,39.82 C11.1 55.83,39.65 50.7,39.65 50.3,39.25 50.3,38.6 49.94,38.24 14.66,38.24 v13.8,39.1
  Bottom 0.305: Q3.SDPAD v20.32,48.26 20.32,50.46 19.43,51.36 D7.3 | R8.1 16.57,41 D6.2 D6.1 13.86,39.16 v13.8,39.1 13.8,41.84 11.02,44.62 U2.P$1 U2.P$2
  other vias: 6.35,46.5 7.62,46.5 8.89,46.5 8.89,44.45 10.16,41.91 10.16,40.64 10.16,39.37 11.43,39.37 12.7,39.37 15.24,39.37 15.24,40.64 10.16,49.53 10.16,50.8 10.16,52.07 11.43,52.07 12.7,52.07 15.24,52.07 15.24,50.8 16.51,50.8 16.51,52.07 17.78,50.8 17.78,52.07 19.05,50.8 19.05,52.07 20.32,50.8 20.32,52.07 19.05,48.26 19.05,46.99 20.32,46.99
  pour Bottom (no thermals): 5.7,47.3 8.9,47.3 8.9,53.4 21.5,53.4 21.5,45.8 18.9,45.8 18.9,37.7 9.3,37.7 9.3,43.3 5.7,43.3
  pour Top (no thermals): 5.7,47.3 8.9,47.3 8.9,53.4 21.5,53.4 21.5,45.8 18.9,45.8 18.9,37.7 9.3,37.7 9.3,43.3 5.7,43.3
PHASE_W_OUT  (via drill 0.35, 3.1)
  Bottom 0.305: U2.P$3 U2.P$4
  other vias: 4,39.25 0.81,45.23 0.81,46.5 2.08,46.5 3.35,46.5 4.62,46.5 1.27,41.91 1.27,40.64 6.35,41.91 6.35,40.64 6.35,38.1 6.35,36.83 1.27,36.83 1.27,38.1
  pour Top (no thermals): 0.3,35.3 8.7,35.3 8.7,42.8 5.5,42.8 5.2,42.8 5.2,47.3 4.9,47.3 -2.6,47.3 -2.6,35.3 0.2,35.3
  pour Bottom (no thermals): -2.6,47.3 5.2,47.3 5.2,42.8 8.7,42.8 8.7,35.3 -2.6,35.3
U_CURRENT  (via drill 0.35)
  Top 0.305: U1.P$7 v6.14,2.15
  Bottom 0.305: CON1.P$6 62.52,56.62 arc-90 63.9,58 77.3,58 arc-90 78,57.3 78,1 arc-90 77.5,0.5 7.8,0.5 arc-90 v6.14,2.15
V5  (via drill 0.35)
  Top 0.305: C3.1 68.99,12.7 v69.29,13 | C4.1 75.29,12.7 v75.69,13.1 | C2.1 62.69,12.7 v62.99,13 | R18.2 71.47,37 R16.2 | IC1.PIN20 67.93,34.79 68.83,33.89 68.83,31.1 69.06,30.87 C16.1 | v65.2,18.4 69.73,18.4 v69.73,18.44 69.7,18.47 69.7,21.72 v69.75,21.77
  Bottom 0.305: v69.29,13 69.29,14.5 K2.PIN8 69.2,16.17 69.73,16.7 v69.73,18.44 73.39,18.44 75.55,16.27 K1.PIN8 75.55,14.51 75.69,14.37 v75.69,13.1 | v62.99,13 62.99,14.45 K3.PIN8 62.85,16.04 v65.2,18.39 v65.2,18.4 | R33.1 R32.1 68.06,47.84 69.17,46.73 70.6,46.73 | 70.6,46.73 70.6,42.8 71.49,41.91 R18.2 69.77,35.3 C16.1 69.77,21.79 v69.75,21.77 | 70.6,46.73 R29.1
  other vias: 71.49,37.02 69.77,30.87
VCC  (via drill 0.35)
  Top 0.152: CPOL2.+ v35.56,16.51
  Top 0.305: v68.3,29.7 67.8,30.2 67.8,33.04 67.35,33.49 IC1.PIN18
  Top 0.508: v39.37,11.43 40.64,12.7 49.53,12.7 50.8,13.97 50.8,18.49 D1.A
  Bottom 0.305: D8.C 38.62,6.76 U$22.+ | Q3.DPAD 20.7,43.5 20.7,41.91 | C8.1 22.93,43.77 22.9,43.8 | C9.1 35.43,27.26 CPOL1.+ | D4.3 20.43,24.73 Q2.DPAD | Q1.8 26.62,10.79 C17.1 | D2.3 20.43,8.22 Q1.DPAD | v68.3,29.7 68.3,26.39 63.5,21.59 53.9,21.59 D1.A
  other vias: 36.11,27.94 38.1,27.94 38.1,26.67 39.37,26.67 34.29,40.64 34.29,41.91 36.83,41.91 36.83,40.64 39.37,40.64 39.37,41.91 35.56,55.88 35.56,54.61 34.29,54.61 34.29,55.88 35.56,11.43 34.29,10.16 34.29,8.89 34.29,11.43 34.29,24.13 34.29,22.86 36.83,24.13 36.83,22.86 39.37,24.13 39.37,22.86 34.29,16.51 36.83,16.51 38.1,16.51 34.29,26.67 34.29,27.94 36.83,11.43 35.56,10.16 38.1,10.16 38.1,11.43 39.37,10.16 39.37,8.89 20.32,11.43 22.86,11.43 20.32,10.16 22.86,10.16 20.32,6.35 20.32,7.62 22.86,6.35 22.86,7.62 25.4,6.35 25.4,7.62 27.94,7.62 30.48,6.35 30.48,7.62 30.48,10.16 30.48,11.43 20.32,22.86 20.32,24.13 22.86,22.86 22.86,24.13 25.4,22.86 25.4,24.13 27.94,22.86 27.94,24.13 30.48,22.86 30.48,24.13 30.48,26.67 30.48,27.94 22.86,26.67 22.86,27.94 20.32,26.67 20.32,27.94 20.32,44.45 20.32,43.18 20.32,40.64 22.86,40.64 22.86,43.18 22.86,44.45 25.4,40.64 26.67,40.64 29.21,40.64 30.48,40.64 30.48,43.18 30.48,44.45 52.67,20.36
  pour Bottom (no thermals): 19.1,4.9 40.5,4.9 40.5,12.3 19.1,12.3
  pour Bottom (no thermals): 19.4,21.1 40.5,21.1 40.5,28.8 19.4,28.8
  pour Bottom (no thermals): 19.4,37.7 40.5,37.7 40.5,45.3 19.4,45.3
  pour Top (rank 2, no thermals): 33.3,2 33.3,56.5 40.5,56.5 40.5,2
  pour Bottom (no thermals): 40.5,2 40.5,56.5 33.3,56.5 33.3,2
  pour Top (no thermals): 19.1,12.3 40.5,12.3 40.5,4.9 19.1,4.9
  pour Top (no thermals): 19.4,28.8 40.5,28.8 40.5,21.1 19.4,21.1
  pour Top (no thermals): 19.4,45.3 40.5,45.3 40.5,37.7 19.4,37.7
VDSTH
  Top 0.305: IC1.PIN21 68.25,35.44 68.71,34.98 R16.1 69.79,34.96 R17.2
VREF+  (via drill 0.35)
  Top 0.305: U1.P$8 7.42,5.93 arc90 C5.1
  Bottom 0.305: C5.1 7.7,1.95 arc90 8.23,1.41 47.81,1.41 arc90 49.1,2.7 49.1,3 arc-90 52,5.9 arc-90 55,2.9 arc90 56.49,1.41 76.5,1.41 arc90 76.84,1.76 76.84,56.31 arc90 76.28,56.88 68.38,56.88 arc90 67.52,56.02 CON1.P$4 67.52,53.52 arc-90 66.6,52.6 51.74,52.6 arc-90 49.1,55.24 49.1,55.9 arc90 47.96,57.04 8.14,57.04 arc90 7.5,56.4 C6.1 7.5,51.62 7.21,51.34 U2.P$8
  other vias: 7.7,5.65 7.5,52.57
VREF-  (via drill 0.35)
  Top 0.305: C6.2 4.37,52.57 arc90 3.4,51.6 v3.4,51.4 | CON1.P$5 65.02,56.18 64.5,56.7 60.6,56.7 60.02,56.12 CON1.P$7 | v3.6,6.3 arc90 v3.6,6.3 U1.P$5
  Bottom 0.305: CON1.P$7 60.02,53.72 | 60.02,53.72 59.6,53.3 56.3,53.3 arc-90 55.5,54.1 55.5,56.94 arc90 54.9,57.54 7.64,57.54 arc90 6.7,56.6 v6.7,54.6 | 60.02,53.72 60.44,53.3 64.7,53.3 65.02,53.62 CON1.P$5 65.02,56.42 arc-90 66,57.4 76.9,57.4 arc-90 77.4,56.9 77.4,1.35 arc-90 77.01,0.96 7.94,0.96 arc-90 7,1.9 7,2.5 arc90 6.5,3 arc-90 6.1,3.4 6.1,5.55 C5.2 4.25,5.65 arc-90 v3.6,6.3 | U2.P$5 v3.4,51.4 arc90 v3.4,51.4
  pour Bottom: 54.8,59.2 68.4,59.2 68.4,52.5 54.8,52.5
  pour Top: 54.9,59.2 68.4,59.2 68.4,52.5 54.8,52.5 54.8,52.7 54.8,59.2
  pour Top: 3,51.1 7.7,51.1 7.7,57 49,57 49,52.5 54.9,52.5 54.9,59.2 3,59.2
  pour Top: 3.2,6.8 7.9,6.8 7.9,1.5 76.8,1.5 76.8,56.1 68.4,56.1 68.4,60.1 80.5,60.1 80.5,-0.9 3.2,-0.9
W_CURRENT
  Bottom 0.305: CON1.P$8 57.52,56.58 arc90 56.1,58 7.38,58 arc90 5.95,56.56 U2.P$7

### Text on the board
bPlace: 0.Hayate | W | SLBL_MotaDora_Ver1 | For CoRE | V | U